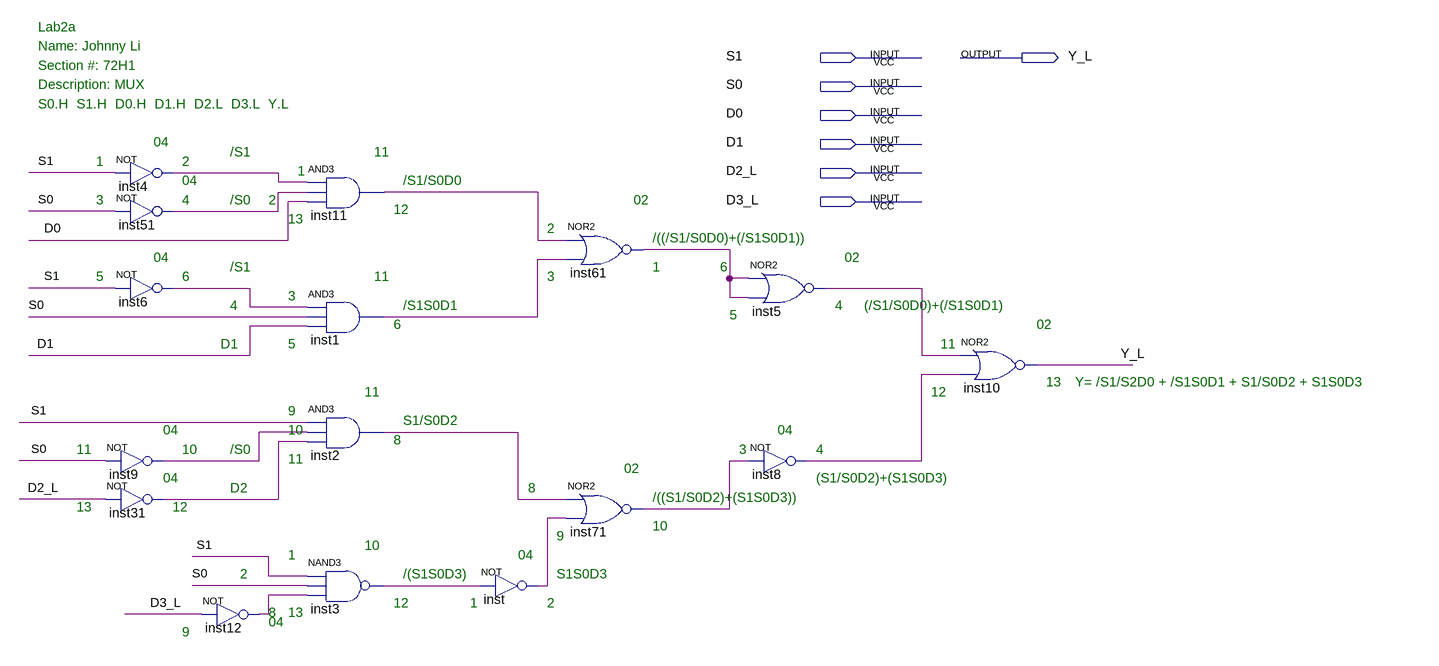
[diagram p0: schematic sheet]
// Quartus schematic lab2_MUX.bdf as structural Verilog: 16 symbols, 7 pins
module lab2_MUX (
  input  S1,
  input  S0,
  input  D0,
  input  D1,
  input  D2_L,
  input  D3_L,
  output Y_L
);

  wire inst1_out, inst2_out, inst3_out, inst4_out, inst5_out, inst6_out, inst8_out, inst9_out, inst11_out,
       inst12_out, inst31_out, inst51_out, inst61_out, inst71_out, inst_out;

  not inst4 (inst4_out, S1);
  not inst51 (inst51_out, S0);
  not inst6 (inst6_out, S1);
  not inst9 (inst9_out, S0);
  not inst31 (inst31_out, D2_L);
  not inst12 (inst12_out, D3_L);
  and inst11 (inst11_out, inst4_out, inst51_out, D0);
  and inst1 (inst1_out, inst6_out, S0, D1);
  and inst2 (inst2_out, S1, inst9_out, inst31_out);
  nand inst3 (inst3_out, S1, S0, inst12_out);
  not inst (inst_out, inst3_out);
  nor inst61 (inst61_out, inst11_out, inst1_out);
  nor inst71 (inst71_out, inst2_out, inst_out);
  nor inst5 (inst5_out, inst61_out, inst61_out);
  not inst8 (inst8_out, inst71_out);
  nor inst10 (Y_L, inst5_out, inst8_out);

  // Notes on the sheet:
  //   Lab2a
  //   Name: Johnny Li
  //   Section #: 72H1
  //   Description: MUX
  //   S0.H  S1.H  D0.H  D1.H  D2.L  D3.L  Y.L
  //   04
  //   /S1
  //   11
  //   1
  //   2
  //   1
  //   04
  //   /S1/S0D0
  //   3
  //   4
  //   /S0
  //   2
  //   02
  //   12
  //   13
  //   2
  //   /((/S1/S0D0)+(/S1S0D1))
  //   04
  //   02
  //   /S1
  //   1
  //   6
  //   5
  //   6
  //   11
  //   3
  //   3
  //   4
  //   /S1S0D1
  //   4
  //   (/S1/S0D0)+(/S1S0D1)
  //   5
  //   6
  //   02
  //   D1
  //   5
  //   11
  //   13
  //   Y= /S1/S2D0 + /S1S0D1 + S1/S0D2 + S1S0D3
  //   11
  //   12
  //   9
  //   S1/S0D2
  //   04
  //   10
  //   04
  //   8
  //   11
  //   10
  //   /S0
  //   3
  //   4
  //   11
  //   02
  //   04
  //   (S1/S0D2)+(S1S0D3)
  //   D2
  //   8
  //   /((S1/S0D2)+(S1S0D3))
  //   13
  //   12
  //   10
  //   9
  //   10
  //   1
  //   04
  //   2
  //   /(S1S0D3)
  //   S1S0D3
  //   12
  //   1
  //   2
  //   8
  //   13
  //   04
  //   9
endmodule
